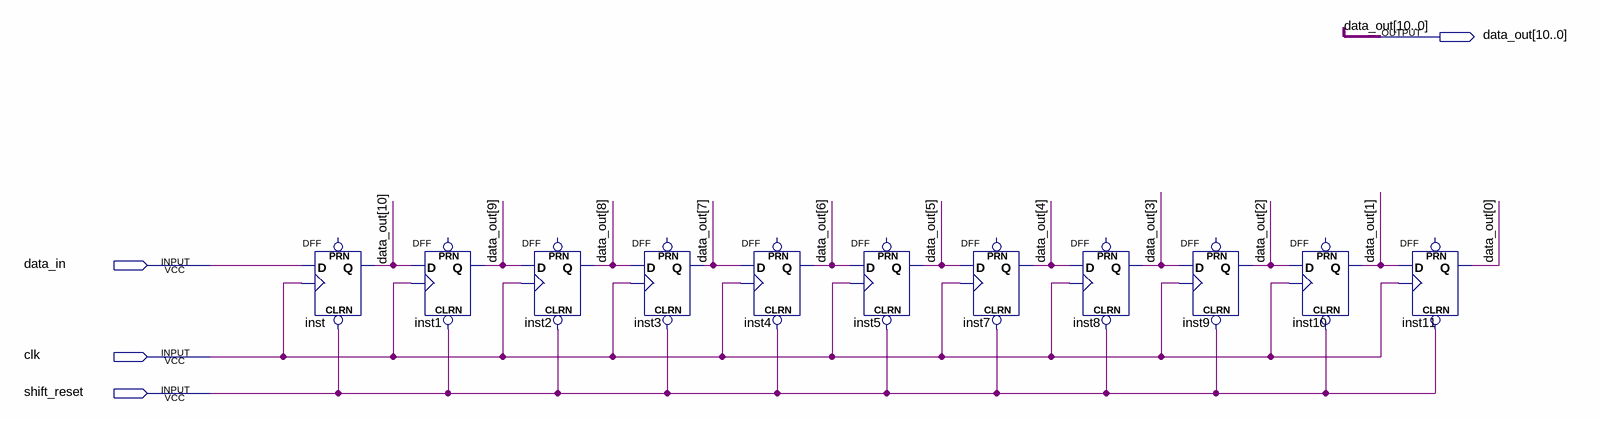
[diagram p0: schematic sheet]
// Quartus schematic shiftRegister.bdf as structural Verilog: 11 symbols, 4 pins
module shiftRegister (
  input  data_in,
  input  clk,
  input  shift_reset,
  output [10:0] data_out
);

  DFF inst (.CLRN(shift_reset), .CLK(clk), .D(data_in), .Q(data_out[10]));  // open: PRN
  DFF inst1 (.CLRN(shift_reset), .CLK(clk), .D(data_out[10]), .Q(data_out[9]));  // open: PRN
  DFF inst2 (.CLRN(shift_reset), .CLK(clk), .D(data_out[9]), .Q(data_out[8]));  // open: PRN
  DFF inst3 (.CLRN(shift_reset), .CLK(clk), .D(data_out[8]), .Q(data_out[7]));  // open: PRN
  DFF inst4 (.CLRN(shift_reset), .CLK(clk), .D(data_out[7]), .Q(data_out[6]));  // open: PRN
  DFF inst5 (.CLRN(shift_reset), .CLK(clk), .D(data_out[6]), .Q(data_out[5]));  // open: PRN
  DFF inst7 (.CLRN(shift_reset), .CLK(clk), .D(data_out[5]), .Q(data_out[4]));  // open: PRN
  DFF inst8 (.CLRN(shift_reset), .CLK(clk), .D(data_out[4]), .Q(data_out[3]));  // open: PRN
  DFF inst9 (.CLRN(shift_reset), .CLK(clk), .D(data_out[3]), .Q(data_out[2]));  // open: PRN
  DFF inst10 (.CLRN(shift_reset), .CLK(clk), .D(data_out[2]), .Q(data_out[1]));  // open: PRN
  DFF inst11 (.CLRN(shift_reset), .CLK(clk), .D(data_out[1]), .Q(data_out[0]));  // open: PRN
endmodule
